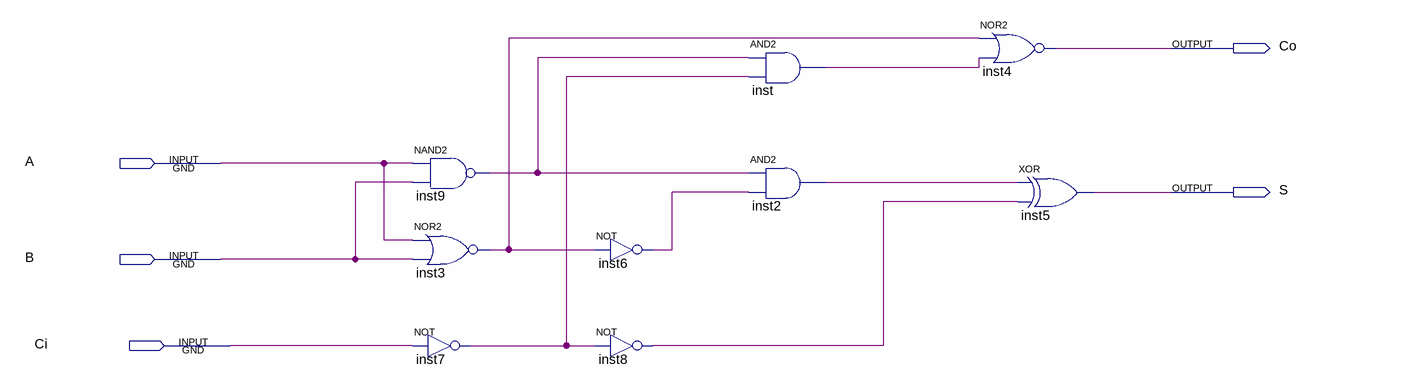
[diagram p0: schematic sheet]
// Quartus schematic ADD1BIT.bdf as structural Verilog: 9 symbols, 5 pins
module ADD1BIT (
  input  A,
  input  B,
  input  Ci,
  output Co,
  output S
);

  wire inst2_out, inst3_out, inst6_out, inst7_out, inst8_out, inst9_out, inst_out;

  nand inst9 (inst9_out, A, B);
  nor inst3 (inst3_out, A, B);
  not inst7 (inst7_out, Ci);
  not inst6 (inst6_out, inst3_out);
  not inst8 (inst8_out, inst7_out);
  and inst (inst_out, inst9_out, inst7_out);
  and inst2 (inst2_out, inst9_out, inst6_out);
  nor inst4 (Co, inst3_out, inst_out);
  xor inst5 (S, inst2_out, inst8_out);
endmodule
